# EAGLE design untitled (EAGLE 9.6.0)
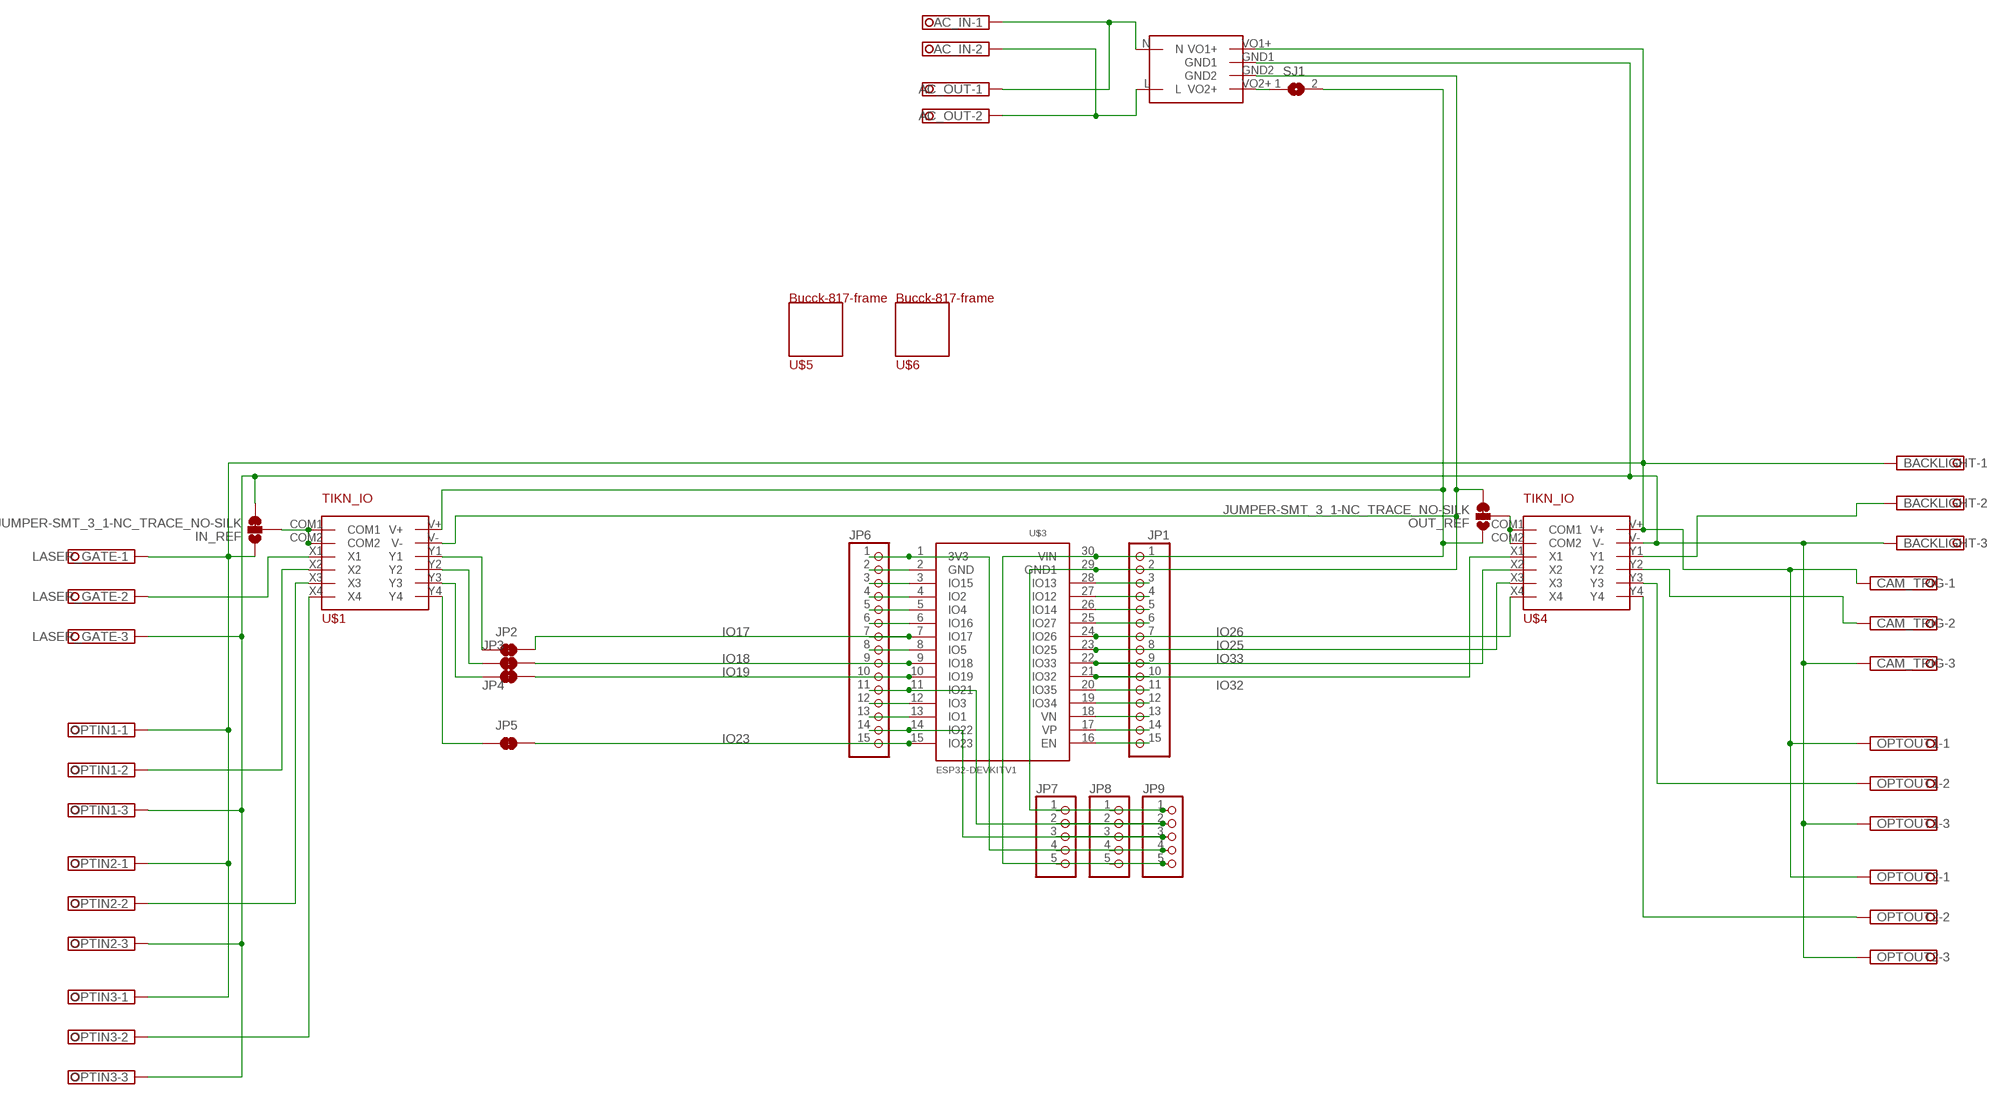
[diagram p0: schematic, sheet 1]

## Parts
AC_IN  TERMINAL-BLOCK-3.5MM-2-PIN-LONG-PAD  [TERMINAL-BLOCK-2-PIN-3.5MM-LONG-PAD]
AC_OUT  TERMINAL-BLOCK-3.5MM-2-PIN-LONG-PAD  [TERMINAL-BLOCK-2-PIN-3.5MM-LONG-PAD]
BACKLIGHT  TERMINAL-BLOCK-3.5MM-3-PIN-LONG-PAD  [TERMINAL-BLOCK-3-PIN-3.5MM-LONG-PAD]
CAM_TRIG  TERMINAL-BLOCK-3.5MM-3-PIN-LONG-PAD  [TERMINAL-BLOCK-3-PIN-3.5MM-LONG-PAD]
IN_REF  JUMPER-SMT_3_1-NC_TRACE_NO-SILK  [SMT-JUMPER_3_1-NC_TRACE_NO-SILK]
JP1  PINHD-1X15  [1X15]
JP2  JUMPER-SMT_2_NC_TRACE_SILK  [SMT-JUMPER_2_NC_TRACE_SILK]
JP3  JUMPER-SMT_2_NC_TRACE_SILK  [SMT-JUMPER_2_NC_TRACE_SILK]
JP4  JUMPER-SMT_2_NC_TRACE_SILK  [SMT-JUMPER_2_NC_TRACE_SILK]
JP5  JUMPER-SMT_2_NC_TRACE_SILK  [SMT-JUMPER_2_NC_TRACE_SILK]
JP6  PINHD-1X15  [1X15]
JP7  PINHD-1X5  [1X05]
JP8  PINHD-1X5  [1X05]
JP9  PINHD-1X5  [1X05]
LASER_GATE  TERMINAL-BLOCK-3.5MM-3-PIN-LONG-PAD  [TERMINAL-BLOCK-3-PIN-3.5MM-LONG-PAD]
OPTIN1  TERMINAL-BLOCK-3.5MM-3-PIN-LONG-PAD  [TERMINAL-BLOCK-3-PIN-3.5MM-LONG-PAD]
OPTIN2  TERMINAL-BLOCK-3.5MM-3-PIN-LONG-PAD  [TERMINAL-BLOCK-3-PIN-3.5MM-LONG-PAD]
OPTIN3  TERMINAL-BLOCK-3.5MM-3-PIN-LONG-PAD  [TERMINAL-BLOCK-3-PIN-3.5MM-LONG-PAD]
OPTOUT1  TERMINAL-BLOCK-3.5MM-3-PIN-LONG-PAD  [TERMINAL-BLOCK-3-PIN-3.5MM-LONG-PAD]
OPTOUT2  TERMINAL-BLOCK-3.5MM-3-PIN-LONG-PAD  [TERMINAL-BLOCK-3-PIN-3.5MM-LONG-PAD]
OUT_REF  JUMPER-SMT_3_1-NC_TRACE_NO-SILK  [SMT-JUMPER_3_1-NC_TRACE_NO-SILK]
SJ1  SJW  [SJW]
U$1  TIKN_IO_ISOLATOR2  [IO_ISOLATOR2]
U$2  AM22-24W1205V  [AM22-24W1205V]
U$3  ESP32DEVKITV1  [ESP32-DEVKITV1]
U$4  TIKN_IO_ISOLATOR2  [IO_ISOLATOR2]
U$5  BUCC-817  [BUCCK-817]
U$6  BUCC-817  [BUCCK-817]

## Nets
IO17 [3.3vSig]: JP2.2 JP6.7 U$3.7(IO17)
IO18 [3.3vSig]: JP3.2 JP6.9 U$3.9(IO18)
IO19 [3.3vSig]: JP4.2 JP6.10 U$3.10(IO19)
IO23 [3.3vSig]: JP5.2 JP6.15 U$3.15(IO23)
IO25 [3.3vSig]: JP1.8 U$3.23(IO25) U$4.X3
IO26 [3.3vSig]: JP1.7 U$3.24(IO26) U$4.X4
IO32 [3.3vSig]: JP1.10 U$3.21(IO32) U$4.X1
IO33 [3.3vSig]: JP1.9 U$3.22(IO33) U$4.X2
N$1 [5vPow]: JP1.1 JP7.5 JP8.5 JP9.5 OUT_REF.1 SJ1.2 U$1.V+ U$3.30(VIN)
N$2 [5vPow]: SJ1.1 U$2.VO2+
N$3 [5vPow]: JP1.2 JP7.1 JP8.1 JP9.1 OUT_REF.3 U$1.V- U$2.GND2 U$3.29(GND1)
N$4 [12vPow]: BACKLIGHT.3 CAM_TRIG.3 IN_REF.3 LASER_GATE.3 OPTIN1.3 OPTIN2.3 OPTIN3.3 OPTOUT1.3 OPTOUT2.3 U$2.GND1 U$4.V-
N$5 [3.3vSig]: IN_REF.2 U$1.COM1 U$1.COM2
N$6 [3.3vSig]: OUT_REF.2 U$4.COM1 U$4.COM2
N$7 [3.3vSig]: JP2.1 U$1.Y1
N$8 [12vPow]: BACKLIGHT.1 CAM_TRIG.1 IN_REF.1 LASER_GATE.1 OPTIN1.1 OPTIN2.1 OPTIN3.1 OPTOUT1.1 OPTOUT2.1 U$2.VO1+ U$4.V+
N$9 [3.3vSig]: JP5.1 U$1.Y4
N$10 [3.3vSig]: JP4.1 U$1.Y3
N$11 [3.3vSig]: JP3.1 U$1.Y2
N$17 [3.3vSig]: JP6.8 U$3.8(IO5)
N$18 [110vPow]: AC_IN.1 AC_OUT.1 U$2.N
N$19 [12vPow]: BACKLIGHT.2 U$4.Y1
N$20 [110vPow]: AC_IN.2 AC_OUT.2 U$2.L
N$21 [5vPow]: LASER_GATE.2 U$1.X1
N$22 [12vPow]: CAM_TRIG.2 U$4.Y2
N$23 [5vPow]: OPTIN1.2 U$1.X2
N$24 [5vPow]: OPTIN2.2 U$1.X3
N$25 [5vPow]: OPTIN3.2 U$1.X4
N$26 [12vPow]: OPTOUT1.2 U$4.Y3
N$27 [12vPow]: OPTOUT2.2 U$4.Y4
N$28 [3.3vSig]: JP6.1 JP7.4 JP8.4 JP9.4 U$3.1(3V3)
N$29 [3.3vSig]: JP6.2 U$3.2(GND)
N$30 [3.3vSig]: JP6.3 U$3.3(IO15)
N$31 [3.3vSig]: JP6.4 U$3.4(IO2)
N$32 [3.3vSig]: JP6.5 U$3.5(IO4)
N$33 [3.3vSig]: JP6.6 U$3.6(IO16)
N$35 [3.3vSig]: JP6.11 JP7.2 JP8.2 JP9.2 U$3.11(IO21)
N$36 [3.3vSig]: JP6.12 U$3.12(IO3)
N$37 [3.3vSig]: JP6.13 U$3.13(IO1)
N$38 [3.3vSig]: JP6.14 JP7.3 JP8.3 JP9.3 U$3.14(IO22)
N$39 [3.3vSig]: JP1.3 U$3.28(IO13)
N$40 [3.3vSig]: JP1.4 U$3.27(IO12)
N$41 [3.3vSig]: JP1.5 U$3.26(IO14)
N$42 [3.3vSig]: JP1.6 U$3.25(IO27)
N$43 [3.3vSig]: JP1.11 U$3.20(IO35)
N$44 [3.3vSig]: JP1.12 U$3.19(IO34)
N$45 [3.3vSig]: JP1.13 U$3.18(VN)
N$46 [3.3vSig]: JP1.14 U$3.17(VP)
N$47 [3.3vSig]: JP1.15 U$3.16(EN)

## Library data of the parts
AC_IN AC_OUT = Rembrandt Electronics - Terminal Block 3-5mm v1-0 3:TERMINAL-BLOCK-3.5MM-2-PIN: Terminal Block 3.5mm Pitch: 3,5 mm Number of pins: 2 Created by Rembrandt Electronics www.rembrandtelectronics.com
BACKLIGHT CAM_TRIG LASER_GATE OPTIN1-OPTIN3 OPTOUT1 OPTOUT2 = Rembrandt Electronics - Terminal Block 3-5mm v1-0 3:TERMINAL-BLOCK-3.5MM-3-PIN: Terminal Block 3.5mm Pitch: 3,5 mm Number of pins: 3 Created by Rembrandt Electronics www.rembrandtelectronics.com
IN_REF OUT_REF = SparkFun-Jumpers:JUMPER-SMT_3_1-NC_TRACE: Normally closed trace jumper (1 of 2 connections) This jumper has a trace between two pads so it's normally closed (NC). The other connection is normally open (NO). Use a razor knife to open the connection. For best results follow the IPC guidelines for cutting traces: Cutout at least 0.063 mm (0.005 in). Remove all loose material to clean up the cut area. Seal the cut with an approved epoxy. Reapply solder to reclose the connection, or to close the NO connection.
JP1 JP6 = pinhead:PINHD-1X15: PIN HEADER
JP2-JP5 = SparkFun-Jumpers:JUMPER-SMT_2_NC_TRACE: Normally closed trace jumper This jumper has a trace between two pads so it's normally closed (NC). Use a razor knife to open the connection. For best results follow the IPC guidelines for cutting traces: Cutout at least 0.063 mm (0.005 in). Remove all loose material to clean up the cut area. Seal the cut with an approved epoxy. Reapply solder to reclose the connection.
JP7-JP9 = pinhead:PINHD-1X5: PIN HEADER
SJ1 = jumper:SJ: SMD solder JUMPER
U$1 U$4 = IO_Isolator:TIKN_IO_ISOLATOR2
U$2 = AC2DC12V:AM22-24W1205V
U$3 = ESP32-DEVKITV1:ESP32DEVKITV1
U$5 U$6 = IO_Isolator:BUCC-817

## Net classes
1 3.3vSig: width 0.305 mm, drill 0.508 mm, clearance 0.305 mm
2 12vPow: width 2 mm, drill 3 mm, clearance 1 mm
3 5vPow: width 0.8 mm, drill 1 mm, clearance 0.4 mm
4 110vPow: width 2 mm, drill 3 mm, clearance 1 mm

## Board
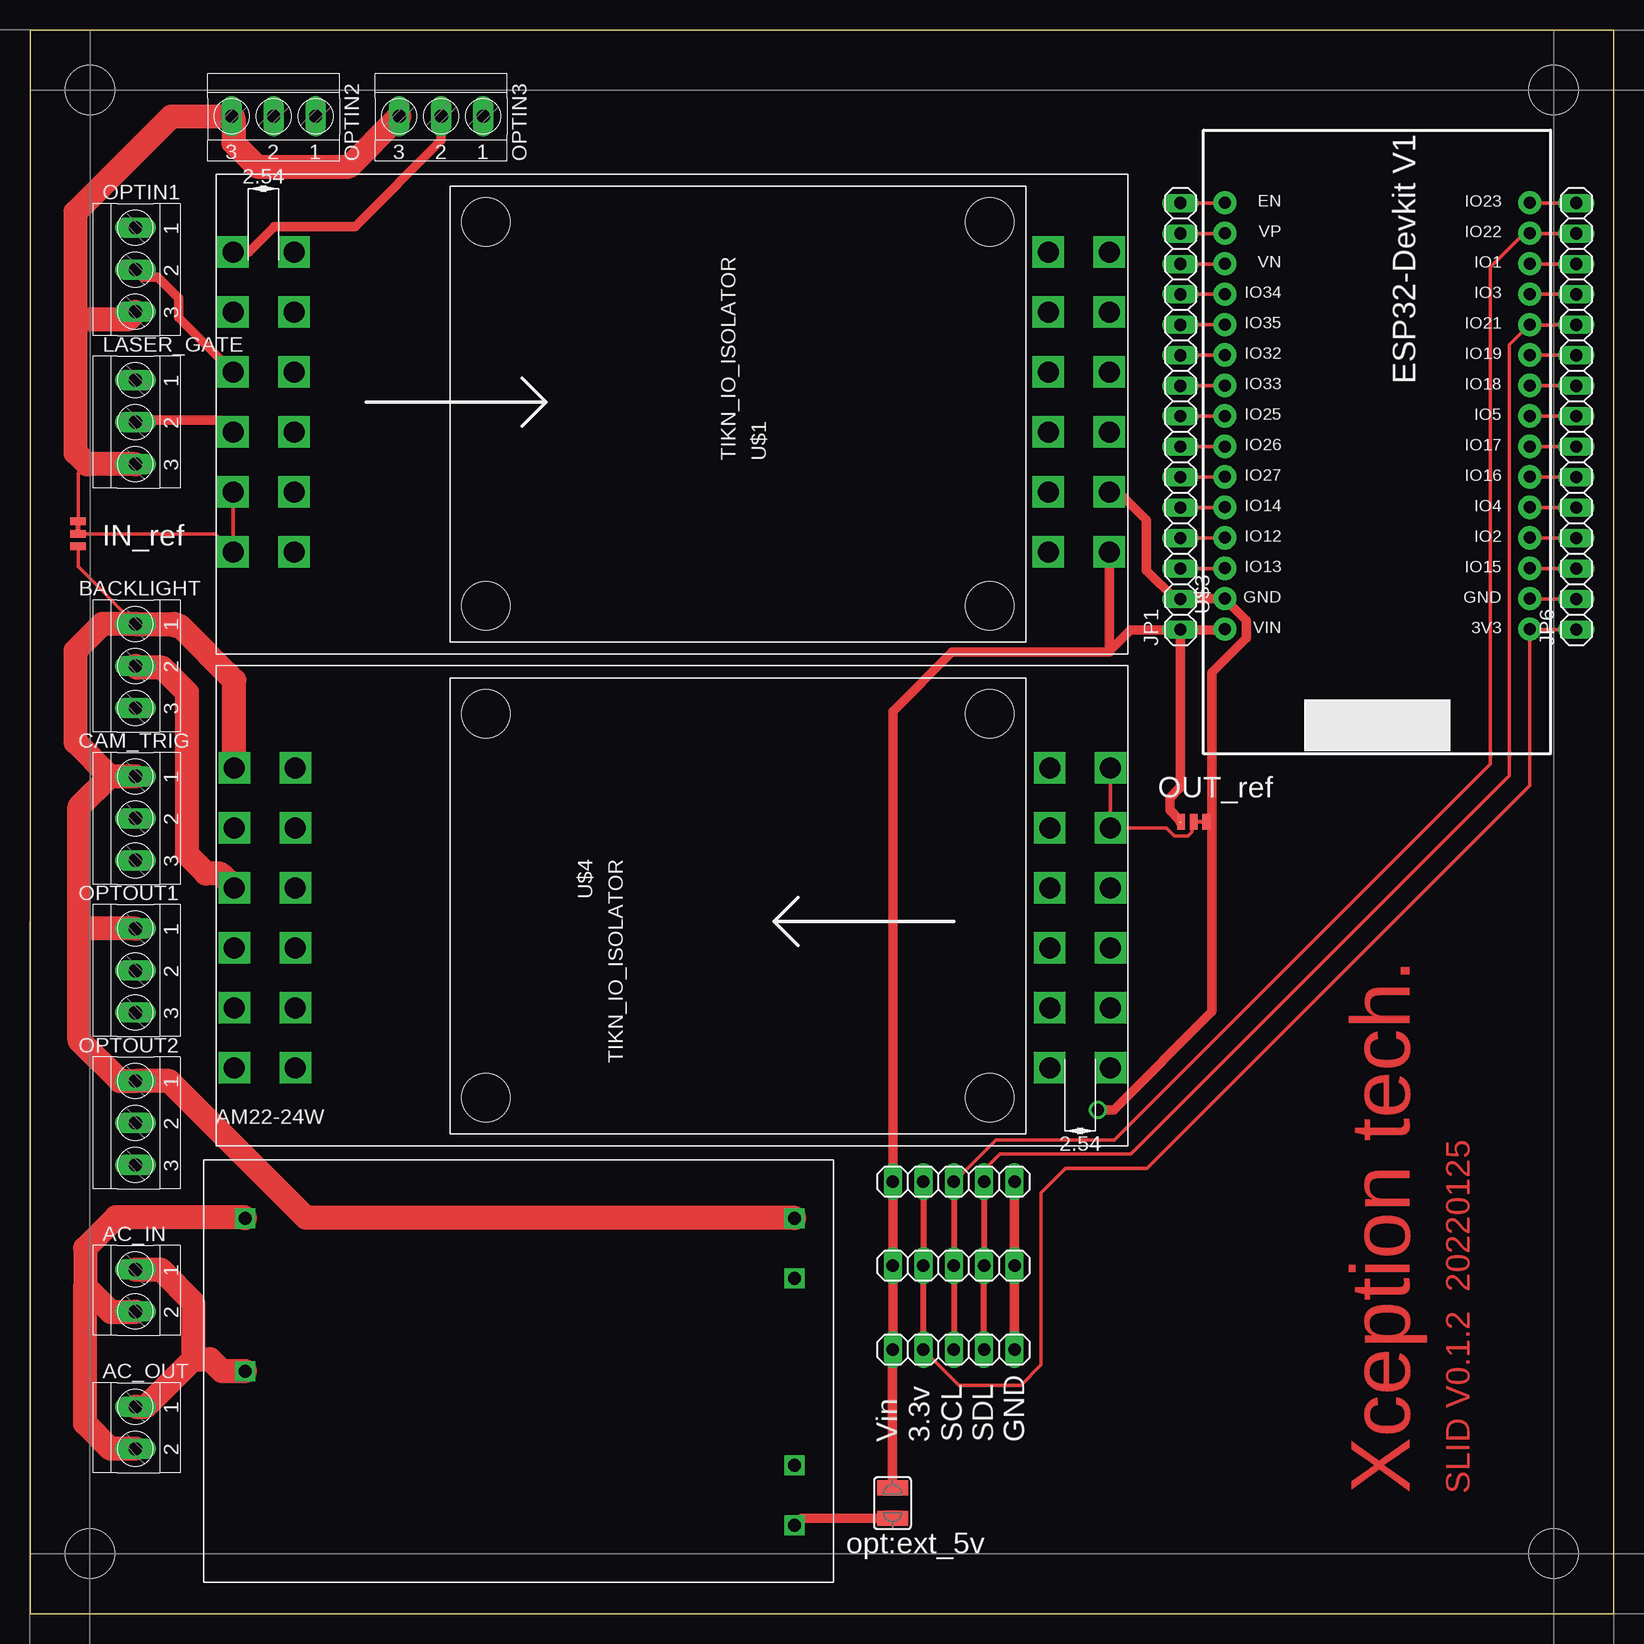
[diagram p1: board, top side]
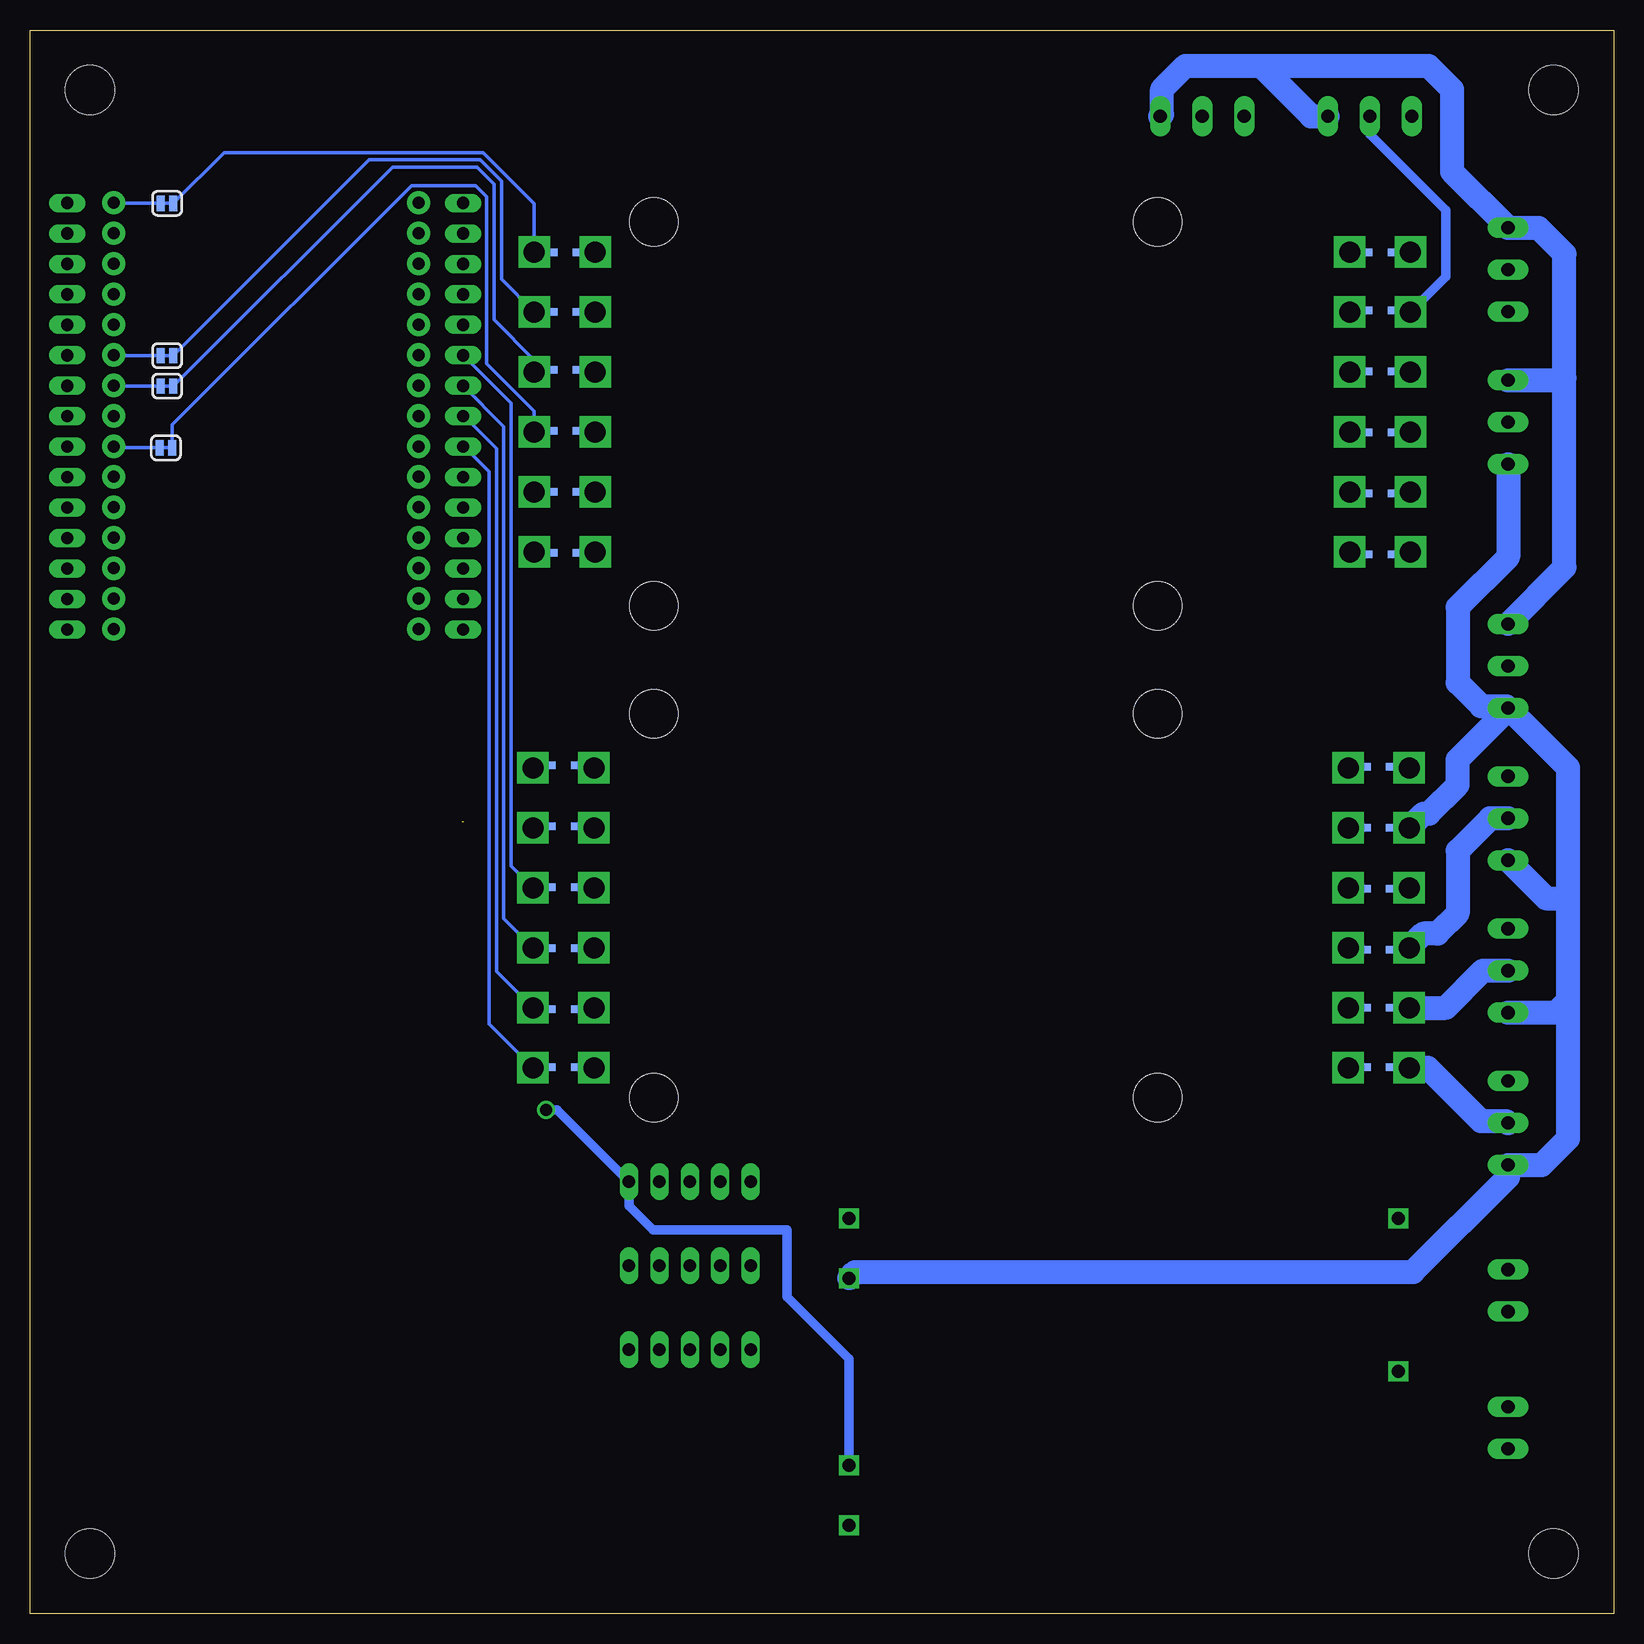
[diagram p2: board, bottom side, seen from below]

Size 132 x 132 mm. Coordinates in mm from the lower left corner, seen from the top.
Outline: 0,0 132,0 132,132 0,132 0,0
Copper layers (1*16): Top 0.035mm / dielectric 1.5mm / Bottom 0.035mm
Design rules "default": minimum track width 6mil, minimum drill 0.35mm, track to track 6mil, track to pad 6mil, pad to pad 6mil, via to via 6mil, smd to smd 6mil, copper to edge 40mil, drill to drill 6mil, minimum pad ring 10mil, minimum via ring 8mil, stop-mask expansion 4mil, vias tented up to drill 0mil, thermal gap 10mil
Holes 4.1 mm at 5,127 127,127 127,5 5,5

### Footprints (pad centres in the part's own frame; a part is rotated, then mirrored left to right if it is on the bottom)
TERMINAL-BLOCK-2-PIN-3.5MM-LONG-PAD = drill 1.1 pad 1.7 long: 1 -1.75,-0.1; 2 1.75,-0.1
TERMINAL-BLOCK-3-PIN-3.5MM-LONG-PAD = drill 1.1 pad 1.7 long: 1 -3.5,-0.1; 2 0,-0.1; 3 3.5,-0.1
SMT-JUMPER_3_1-NC_TRACE_NO-SILK = smd 0.66 x 1.27: 1 -1.041,0; 2 0,0; 3 1.041,0
1X15 = drill 1.016 long: 1 -17.78,0; 2 -15.24,0; 3 -12.7,0; 4 -10.16,0; 5 -7.62,0; 6 -5.08,0; 7 -2.54,0; 8 0,0; 9 2.54,0; 10 5.08,0; 11 7.62,0; 12 10.16,0; 13 12.7,0; 14 15.24,0; 15 17.78,0
SMT-JUMPER_2_NC_TRACE_SILK = smd 0.66 x 1.27: 1 -0.521,0; 2 0.521,0
1X05 = drill 1.016 long: 1 -5.08,0; 2 -2.54,0; 3 0,0; 4 2.54,0; 5 5.08,0
SJW = smd 1.27 x 2.54: 1 -1.27,0; 2 1.27,0
IO_ISOLATOR2 = drill 1.75 square: _COM1 -12.5,32; _COM2 -7.5,32; _V+ -12.5,-30.89; _V- -7.5,-30.89; _X1 -2.5,32; _X2 2.5,32; _X3 7.5,32; _X4 12.5,32; _Y1 -2.5,-30.89; _Y2 2.5,-30.89; _Y3 7.5,-30.89; _Y4 12.5,-30.89; COM1 -12.5,37.08; COM2 -7.5,37.08; V+ -12.5,-35.97; V- -7.5,-35.97; X1 -2.5,37.08; X2 2.5,37.08; X3 7.5,37.08; X4 12.5,37.08; Y1 -2.5,-35.97; Y2 2.5,-35.97; Y3 7.5,-35.97; Y4 12.5,-35.97 | smd 0.635 x 0.762 bottom: P$1 -7.62,35.56; P$2 -12.7,35.56; P$3 -12.7,33.528; P$4 -7.62,33.528; P$5 -2.54,35.56; P$6 -2.54,33.528; P$7 2.54,35.56; P$8 2.54,33.528; P$9 7.62,35.56; P$10 7.62,33.528; P$11 -12.573,-32.385; P$12 -12.573,-34.417; P$13 -7.493,-32.385; P$14 -7.493,-34.417; P$15 -2.413,-32.385; P$16 -2.413,-34.417; P$17 2.667,-32.385; P$18 2.667,-34.417; P$19 7.493,-32.385; P$20 7.493,-34.417; P$21 12.446,-32.385; P$22 12.446,-34.417; P$23 12.446,35.56; P$24 12.446,33.528
AM22-24W1205V = drill 1.1 square: GND1 49.25,-9.85; GND2 49.25,-25.45; L 3.45,-4.85; N 3.45,-17.6; VO1+ 49.25,-4.85; VO2+ 49.25,-30.45
ESP32-DEVKITV1 = drill 1 pad 1.93: 1 -25.4,-12.702; 2 -22.86,-12.702; 3 -20.32,-12.702; 4 -17.78,-12.702; 5 -15.24,-12.702; 6 -12.7,-12.702; 7 -10.16,-12.702; 8 -7.62,-12.702; 9 -5.08,-12.702; 10 -2.54,-12.702; 11 0,-12.702; 12 2.54,-12.702; 13 5.08,-12.702; 14 7.62,-12.702; 15 10.16,-12.702; 16 10.16,12.698; 17 7.62,12.698; 18 5.08,12.698; 19 2.54,12.698; 20 0,12.698; 21 -2.54,12.698; 22 -5.08,12.698; 23 -7.62,12.698; 24 -10.16,12.698; 25 -12.7,12.698; 26 -15.24,12.698; 27 -17.78,12.698; 28 -20.32,12.698; 29 -22.86,12.698; 30 -25.4,12.698
BUCCK-817 = hole 4: 45,-3; 45,-35; 3,-35; 3,-3

### Placement (x,y rotation side)
AC_IN  8.89,26.92 270 top
AC_OUT  8.89,15.49 270 top
BACKLIGHT  8.89,78.99 270 top
CAM_TRIG  8.89,66.29 270 top
IN_REF  4,90 90 top
JP1  95.9,99.8 90 top
JP2  120.67,97.17 180 bottom
JP3  120.57,102.31 180 bottom
JP4  120.57,104.85 180 bottom
JP5  120.57,117.55 180 bottom
JP6  128.9,99.8 90 top
JP7  77,36 180 top
JP8  77,29 180 top
JP9  77,22 180 top
LASER_GATE  8.89,99.31 270 top
OPTIN1  8.89,112.01 270 top
OPTIN2  20.32,124.71 180 top
OPTIN3  34.29,124.71 180 top
OPTOUT1  8.89,53.59 270 top
OPTOUT2  8.89,40.89 270 top
OUT_REF  97,66 0 top
SJ1  71.9,9.2 90 top
U$1  54,101 90 top
U$2  14.48,37.8 0 top
U$3  112.31,107.45 90 top
U$4  53,58 270 top
U$5  35,119 0 top
U$6  35,78 0 top

### Tracks (layer width: path | path; a pad name or v marks a point on that pad's centre or on a via)
IO17
  Top 0.305: JP6.7 125.03,97.26 U$3.7
  Bottom 0.305: JP2.2 124.89,97.17 U$3.7
IO18
  Top 0.305: JP6.9 125.02,102.34 U$3.9
  Bottom 0.305: JP3.2 125.03,102.31 U$3.9
IO19
  Top 0.305: JP6.10 125.02,104.88 U$3.10
  Bottom 0.305: JP4.2 125.03,104.85 U$3.10
IO23
  Top 0.305: JP6.15 125.02,117.58 U$3.15
  Bottom 0.305: JP5.2 125.03,117.55 U$3.15
IO25
  Top 0.305: JP1.8 95.93,99.83 U$3.23
  Bottom 0.305: U$4.X3 93.12,53.54 93.12,97.12 95.8,99.8 JP1.8
IO26
  Top 0.305: JP1.7 99.57,97.26 U$3.24
  Bottom 0.305: JP1.7 95.8,97.26 93.73,95.19 93.73,49.15 U$4.X4
IO32
  Top 0.305: U$3.21 99.57,104.88 JP1.10
  Bottom 0.305: U$4.X1 91.9,62.32 91.9,100.88 JP1.10
IO33
  Top 0.305: JP1.9 99.63,102.34 U$3.22
  Bottom 0.305: JP1.9 92.51,98.95 92.51,57.93 U$4.X2
N$1  (1 unrouted)
  Top 0.8: SJ1.2 71.9,21.98 JP9.5 JP8.5 JP7.5 71.92,75.18 76.87,80.13 89.97,80.13 U$1.V+ | U$3.30 99.52,81.96 95.96,81.96 JP1.1 | JP1.1 95.88,82 91.74,82 89.97,80.23 | JP1.1 95.9,68.9 95,68 95,66.96 95.87,66.09 95.87,66
N$2
  Top 0.8: SJ1.1 64.31,7.93 U$2.VO2+
N$3  (via drill 1)
  Top 0.8: JP7.1 JP8.1 JP9.1 | v89,42 90.34,42 98.51,50.17 98.51,66 | 98.51,66 98.51,78.45 101.38,81.32 101.38,82.78 99.61,84.55 U$3.29 95.93,84.59 JP1.2 95.47,84.56 93.08,86.95 93.08,91.14 90.73,93.5 U$1.V- | OUT_REF.3 98.51,66
  Bottom 0.8: U$2.GND2 63.73,21.23 68.9,26.41 68.9,32 80.08,32 82.08,34 JP7.1 88.08,42 v89,42
N$4
  Top 0.305: IN_REF.3 4,95.04 4.77,95.81
  Top 2: 3.81,107.87 3.81,96.77 4.77,95.81 LASER_GATE.3 | 3.81,107.87 3.81,116.83 11.79,124.81 OPTIN2.3 16.97,124.66 16.97,122.57 18.93,120.61 26.59,120.61 OPTIN3.3 | OPTIN1.3 8.15,107.87 3.81,107.87
  Bottom 2: 3.81,51.05 3.81,39.58 6,37.39 OPTOUT2.3 8.79,36.39 16.72,28.46 63.21,28.46 U$2.GND1 | OPTOUT1.3 4.77,50.09 3.81,51.05 | BACKLIGHT.3 3.81,70.51 3.81,59.61 | 3.81,59.61 3.81,51.05 | CAM_TRIG.3 5.61,59.61 3.81,59.61 | BACKLIGHT.3 8.94,75.64 11.03,75.64 12.99,77.6 12.99,83.88 8.79,88.08 LASER_GATE.3 | U$4.V- 15.84,66.69 15.38,66.69 12.99,69.08 12.99,71.18 8.79,75.38 BACKLIGHT.3
N$5
  Top 0.305: IN_REF.2 15.42,90 U$1.COM1 U$1.COM2
N$6
  Top 0.305: OUT_REF.2 96.84,65.84 96.84,65.14 96.52,64.81 95.4,64.81 94.71,65.5 U$4.COM2 U$4.COM1
N$7
  Bottom 0.305: JP2.1 120.15,99.09 100.2,119.03 94.87,119.03 93.92,118.09 93.92,104.18 89.97,100.23 U$1.Y1
N$8
  Top 0.305: BACKLIGHT.1 4,87.28 IN_REF.1
  Top 2: 4.12,57.09 4.12,47.79 7.52,44.39 OPTOUT2.1 11.61,44.39 23,33 63.67,33 U$2.VO1+ | CAM_TRIG.1 6.66,69.79 | 6.66,69.79 3.81,72.64 3.81,80.26 6.04,82.49 BACKLIGHT.1 12,82.49 12.15,82.34 12.48,82.34 17.03,77.79 U$4.V+ | OPTOUT1.1 4.12,57.09 | 4.12,57.09 4.12,67.25 6.66,69.79
  Bottom 2: OPTIN3.1 37.64,124.96 37.64,127.05 35.68,129.01 29.4,129.01 | OPTIN2.1 25.2,124.81 29.4,129.01 | 29.4,129.01 15.43,129.01 13.47,127.05 13.47,120.19 OPTIN1.1 6.26,115.51 4.09,113.34 4.09,103 | BACKLIGHT.1 4.09,87.19 4.09,103 | LASER_GATE.1 4.28,102.81 4.09,103
N$9
  Bottom 0.305: JP5.1 115.81,121.79 95,121.79 94.24,121.79 89.97,117.52 U$1.Y4
N$10
  Bottom 0.305: JP4.1 103.72,121.18 96,121.18 94.5,121.18 92.7,119.39 92.7,111.23 U$1.Y3
N$11
  Bottom 0.305: JP3.1 101.79,120.57 94.75,120.57 93.31,119.13 93.31,107.84 89.97,104.5 U$1.Y2
N$17
  Top 0.305: JP6.8 125.03,99.8 U$3.8
N$18
  Top 2: AC_OUT.1 9.64,17.24 13.6,21.19 | 13.6,21.19 15,21.19 16,20.19 U$2.N | AC_IN.1 10.88,28.67 13.6,25.95 13.6,21.19
N$19
  Top 2: U$4.Y1 15.84,61.69 14.68,61.69 13.09,63.28 13.09,76.78 11.03,78.84 8.94,78.84 BACKLIGHT.2
N$20
  Top 2: U$2.L 17.83,33.04 7.18,33.04 4.59,30.45 4.59,27.28 | 4.59,27.28 6.75,25.12 8.74,25.12 AC_IN.2 | 4.59,27.28 4.59,15.85 6.7,13.74 AC_OUT.2
N$21
  Top 0.8: LASER_GATE.2 8.98,99.5 15.92,99.5 U$1.X1
N$22
  Bottom 2: CAM_TRIG.2 10.29,66.29 13,63.58 13,58.37 14.68,56.69 15.84,56.69 U$4.Y2
N$23
  Top 0.8: U$1.X2 12.39,108.03 12.39,109.65 10.63,111.41 9.39,111.41 OPTIN1.2
N$24
  Bottom 0.8: OPTIN2.2 20.32,123.32 14,117 14,111.42 U$1.X3
N$25
  Top 0.8: OPTIN3.2 34.29,122.81 27.09,115.61 20.36,115.61 18.24,113.5 U$1.X4
N$26
  Bottom 2: U$4.Y3 13.97,50.5 10.88,53.59 OPTOUT1.2
N$27
  Bottom 2: OPTOUT2.2 8.94,41.04 11.03,41.04 15.49,45.5 U$4.Y4
N$28
  Top 0.305: JP6.1 125.03,82.02 U$3.1 125.01,69.01 93.1,37.1 86.3,37.1 84.28,35.08 84.28,20.72 82.58,19.02 77.44,19.02 JP9.4
  Top 0.508: JP7.4 JP8.4 JP9.4
N$29
  Top 0.305: JP6.2 125.03,84.56 U$3.2
N$30
  Top 0.305: JP6.3 125.03,87.1 U$3.3
N$31
  Top 0.305: JP6.4 125.03,89.64 U$3.4
N$32
  Top 0.305: JP6.5 125.03,92.18 U$3.5
N$33
  Top 0.305: JP6.6 125.03,94.72 U$3.6
N$35
  Top 0.305: 124.95,107.38 U$3.11 | 124.95,107.38 127.1,107.38 127.14,107.42 JP6.11 | 124.95,107.38 123.33,105.76 123.33,69.87 91.76,38.3 80.84,38.3 79.54,37 JP7.2
  Top 0.508: JP7.2 JP8.2 JP9.2
N$36
  Top 0.305: JP6.12 125.03,109.96 U$3.12
N$37
  Top 0.305: JP6.13 125.03,112.5 U$3.13
N$38
  Top 0.305: JP6.14 125.03,115.04 U$3.14 125.35,115.87 121.72,112.24 121.72,70.82 90.4,39.5 80.5,39.5 JP7.3
  Top 0.508: JP7.3 JP8.3 JP9.3
N$39
  Top 0.305: JP1.3 99.57,87.1 U$3.28
N$40
  Top 0.305: U$3.27 99.57,89.64 JP1.4
N$41
  Top 0.305: U$3.26 99.57,92.18 JP1.5
N$42
  Top 0.305: JP1.6 99.57,94.72 U$3.25
N$43
  Top 0.305: JP1.11 99.54,107.42 U$3.20
N$44
  Top 0.305: U$3.19 99.54,109.96 JP1.12
N$45
  Top 0.305: JP1.13 99.54,112.5 U$3.18
N$46
  Top 0.305: U$3.17 99.54,115.04 JP1.14
N$47
  Top 0.305: JP1.15 99.54,117.58 U$3.16

### Text on the board
Top: Xception tech. | SLID V0.1.2 20220125
tNames: IN_ref | OUT_ref | Vin | 3.3v | SCL | SDL | GND | opt:ext_5v
tStop: Xception tech. | SLID V0.1.2 20220125